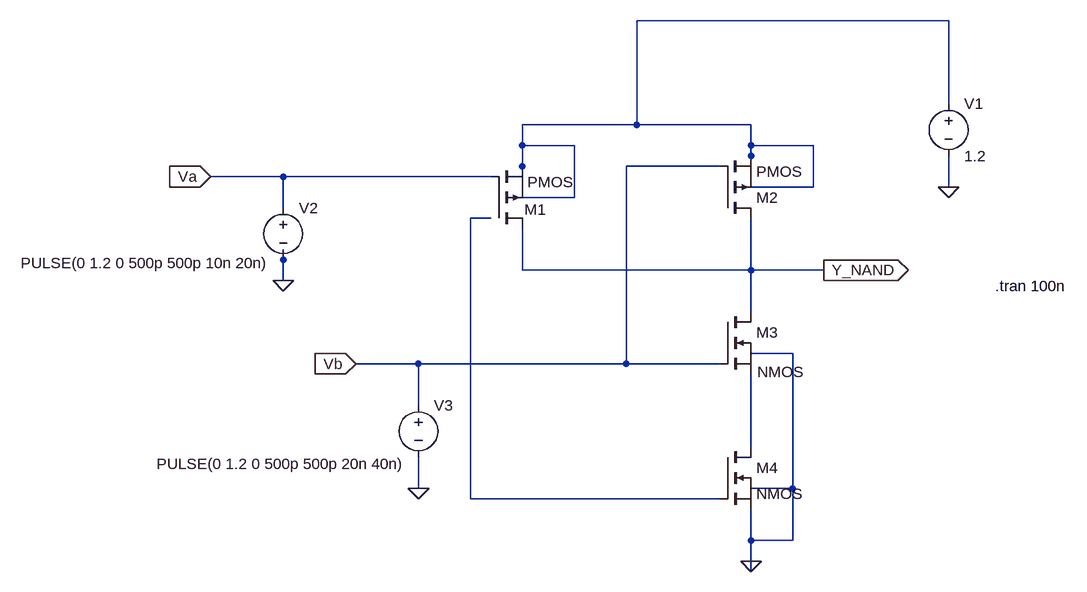
[diagram p0: schematic CMOS NAND.asc]
CMOS NAND.asc, the LTspice schematic file:
Version 4.1
SHEET 1 952 680
WIRE 656 -416 176 -416
WIRE 656 -288 656 -416
WIRE 176 -256 176 -416
WIRE 176 -256 0 -256
WIRE 352 -256 176 -256
WIRE 0 -224 0 -256
WIRE 80 -224 0 -224
WIRE 352 -224 352 -256
WIRE 448 -224 352 -224
WIRE 352 -208 352 -224
WIRE 0 -192 0 -224
WIRE 304 -192 160 -192
WIRE 352 -192 352 -208
WIRE -368 -176 -480 -176
WIRE -48 -176 -368 -176
WIRE 0 -176 0 -192
WIRE 448 -160 448 -224
WIRE 448 -160 352 -160
WIRE 656 -160 656 -208
WIRE 80 -144 80 -224
WIRE 80 -144 -16 -144
WIRE -368 -128 -368 -176
WIRE -48 -112 -80 -112
WIRE -368 -48 -368 -64
WIRE 0 -32 0 -96
WIRE 352 -32 352 -112
WIRE 352 -32 0 -32
WIRE 464 -32 352 -32
WIRE -368 -16 -368 -48
WIRE 352 32 352 -32
WIRE 416 96 352 96
WIRE -160 112 -256 112
WIRE 160 112 160 -192
WIRE 160 112 -160 112
WIRE 304 112 160 112
WIRE -160 176 -160 112
WIRE 352 240 352 128
WIRE -160 304 -160 256
WIRE 416 304 416 96
WIRE 416 304 352 304
WIRE -80 320 -80 -112
WIRE 304 320 -80 320
WIRE 352 384 352 336
WIRE 416 384 416 304
WIRE 416 384 352 384
WIRE 352 416 352 384
WIRE 352 432 352 416
FLAG 352 416 0
FLAG -480 -176 Va
IOPIN -480 -176 In
FLAG -256 112 Vb
IOPIN -256 112 In
FLAG 464 -32 Y_NAND
IOPIN 464 -32 Out
FLAG 656 -160 0
FLAG -368 -16 0
FLAG -160 304 0
SYMBOL pmos -48 -96 M180
WINDOW 0 51 29 Left 2
SYMATTR InstName M1
SYMBOL pmos 304 -112 M180
SYMATTR InstName M2
SYMBOL nmos 304 32 R0
WINDOW 3 58 93 Left 2
SYMATTR InstName M3
SYMBOL nmos 304 240 R0
SYMATTR InstName M4
SYMBOL voltage 656 -304 R0
WINDOW 123 0 0 Left 0
WINDOW 39 0 0 Left 0
SYMATTR InstName V1
SYMATTR Value 1.2
SYMBOL voltage -368 -144 R0
WINDOW 123 0 0 Left 0
WINDOW 39 0 0 Left 0
WINDOW 3 -404 101 Left 2
SYMATTR Value PULSE(0 1.2 0 500p 500p 10n 20n)
SYMATTR InstName V2
SYMBOL voltage -160 160 R0
WINDOW 123 0 0 Left 0
WINDOW 39 0 0 Left 0
WINDOW 3 -403 106 Left 2
SYMATTR Value PULSE(0 1.2 0 500p 500p 20n 40n)
SYMATTR InstName V3
TEXT 728 -8 Left 2 !.tran 100n

The netlist it stands for:
* CMOS NAND.asc
M1 Y_NAND Va N001 N001 PMOS
M2 Y_NAND Vb N001 N001 PMOS
M3 Y_NAND Vb N003 N003 NMOS
M4 N003 N002 0 0 NMOS
V1 N001 0 1.2
V2 Va 0 PULSE(0 1.2 0 500p 500p 10n 20n)
V3 Vb 0 PULSE(0 1.2 0 500p 500p 20n 40n)
.model NMOS NMOS
.model PMOS PMOS
.lib standard.mos
.tran 100n
.backanno
.end